# Altium schematic sheet Connectors.SchDoc
size A4
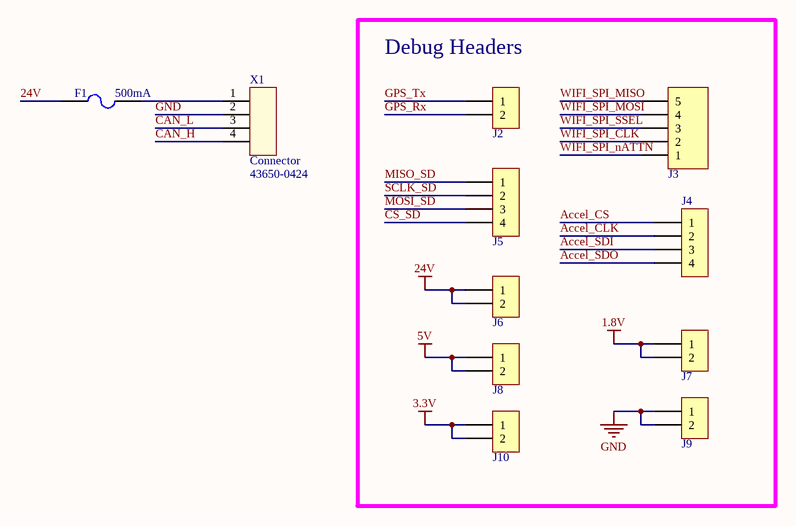
[diagram p0: Connectors.SchDoc]

## Parts
F1  value 500mA  [154_OMNI-BLOK]  (hidden comment: Fuse Holder)
J2  Header 2  [HDR1X2]  (value not drawn)
J3  Header, Xbee SPI  [HDR1X5]  (value not drawn)
J4  Header 4  [HDR1X4]  (value not drawn)
J5  SD SPI  [HDR1X4]  (value not drawn)
J6  Header for debugging  [HDR1X2]  (value not drawn)
J7  Header for debugging  [HDR1X2]  (value not drawn)
J8  Header for debugging  [HDR1X2]  (value not drawn)
J9  Header for debugging  [HDR1X2]  (value not drawn)
J10  Header for debugging  [HDR1X2]  (value not drawn)
X1  Connector  Part_Number: 43650-0424  [43650-0400]

## Blocks framed on the sheet
Debug Headers: J2-J10

## Nets
1.8V: J7.1 J7.2
3.3V: J10.1 J10.2
5V: J8.1 J8.2
24V: F1.2 J6.1 J6.2
GND: J9.1 J9.2 X1.2
Accel_CLK: J4.2
Accel_CS: J4.1
Accel_SDI: J4.3
Accel_SDO: J4.4
CAN_H: X1.4
CAN_L: X1.3
CS_SD: J5.4
GPS_Rx: J2.2
GPS_Tx: J2.1
MISO_SD: J5.1
MOSI_SD: J5.3
SCLK_SD: J5.2
WIFI_SPI_CLK: J3.2
WIFI_SPI_MISO: J3.5
WIFI_SPI_MOSI: J3.4
WIFI_SPI_nATTN: J3.1
WIFI_SPI_SSEL: J3.3
NetF1_1: F1.1 X1.1

## Library data of the parts
F1 = 0453.500MR: 500mA Surface Mount Fuses 453 Series NANO2® Very Fast-Acting Fuse; Part_Number: 0154010.DR; Manufacturer: Littelfuse Inc.; Rated_Voltage_DC: 125V; Part_Number_Fuse: 0453.500MR; Supplier_Link_Fuse: http://www.digikey.ca/product-detail/en/0453.500MR/F3135CT-ND/1984431; Supplier_Link: http://www.digikey.ca/product-detail/en/0154010.DR/F1251CT-ND/565519; Supplier 1: Digi-Key; Supplier Part Number 1: F1251CT-ND; Supplier 2: Digi-Key; Supplier Part Number 2: F3135CT-ND
J2 J6-J10 = Header 2: Header, 2-Pin
J3 = Header 5: Header, 5-Pin
J4 J5 = Header 4: Header, 4-Pin
X1 = 43650-0400: Molex Micro-Fit 3.0, 4 Circuits, Single Row, Right-Angle Through-Hole Header, 3.00mm Pitch, with Solder Tab, Tin, Glow Wire Capable, Black; Part_Number_Crimp: 43030-0001; Part_Number_Mating: 43645-0400; Manufacturer: Molex, LLC; Mounting_Type: SMD, Vertical; Supplier_Link: http://www.digikey.ca/product-detail/en/molex-llc/0436500424/WM2629CT-ND/1634981; Supplier_Link_Crimp: http://www.digikey.ca/product-detail/en/molex-llc/0430300001/WM1837CT-ND/467810; Supplier_Link_Mating: http://www.digikey.ca/products/en?keywords=43645-0400